# Altium schematic sheet DACard.SchDoc: 32-Channel 12-bit DA-Card (Range: 0-23V)
size A4; SheetNumber: 1; SheetTotal: 3
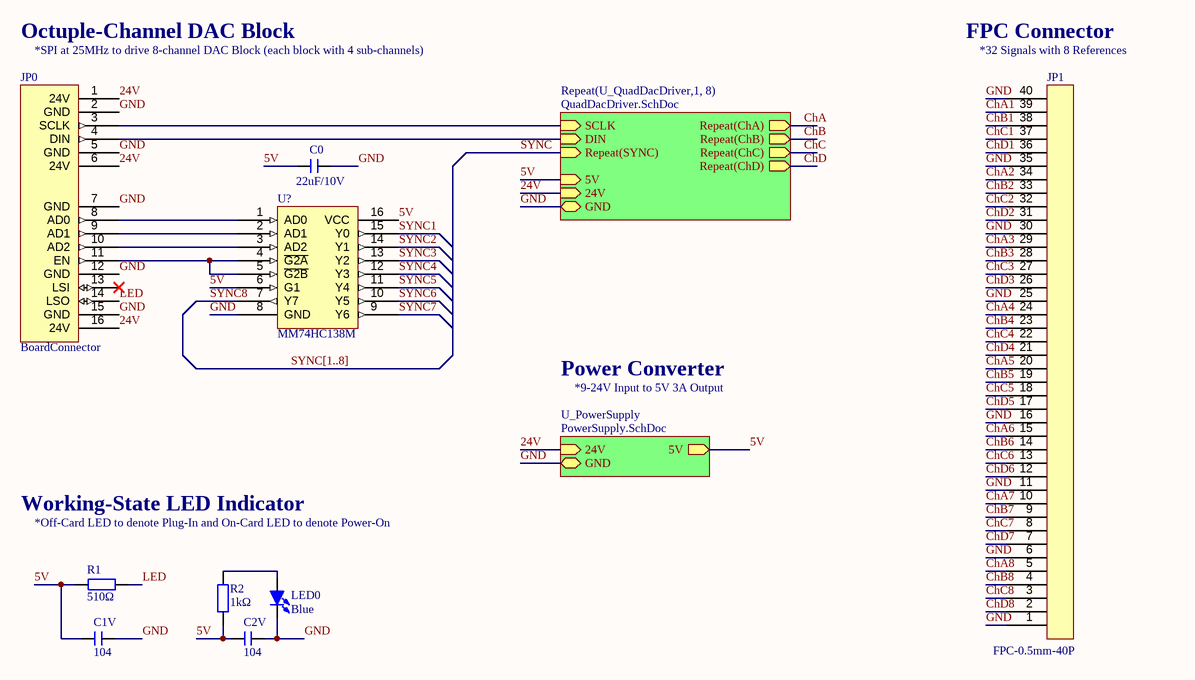
[diagram p0: DACard.SchDoc]

## Parts
C0  22uF/10V  [C 0603_L]
C1V  104  [C 0603_L]
C2V  104  [C 0603_L]
JP0  BoardConnector  [HDR2.54-DIY16-PW]
JP1  FPC-0.5mm-40P  [FPC0.5 2H-WS-40P]
LED0  Blue  [LED 0603B]
R1  510Ω  [R 0603_L]
R2  1kΩ  [R 0603_L]
U?  MM74HC138M  [SO16NB]

## Sub-sheets
Repeat(U_QuadDacDriver,1, 8) = QuadDacDriver.SchDoc: SCLK (in), Repeat(SYNC) (in), DIN (in), 5V (in), GND (bidir), 24V (in), Repeat(ChA) (out), Repeat(ChB) (out), Repeat(ChC) (out), Repeat(ChD) (out)
U_PowerSupply = PowerSupply.SchDoc: 24V (in), GND (bidir), 5V (out)

## Nets
5V: C0.1 C1V.1 C2V.1 R1.1 R2.1 U?.6(G1) U?.16(VCC) ; sheet U_PowerSupply/5V, sheet Repeat(U_QuadDacDriver,1, 8)/5V
24V: JP0.1(24V) JP0.6(24V) JP0.16(24V) ; sheet U_PowerSupply/24V, sheet Repeat(U_QuadDacDriver,1, 8)/24V
ChA: sheet Repeat(U_QuadDacDriver,1, 8)/Repeat(ChA)
ChA1: JP1.39
ChA2: JP1.34
ChA3: JP1.29
ChA4: JP1.24
ChA5: JP1.20
ChA6: JP1.15
ChA7: JP1.10
ChA8: JP1.5
ChB: sheet Repeat(U_QuadDacDriver,1, 8)/Repeat(ChB)
ChB1: JP1.38
ChB2: JP1.33
ChB3: JP1.28
ChB4: JP1.23
ChB5: JP1.19
ChB6: JP1.14
ChB7: JP1.9
ChB8: JP1.4
ChC: sheet Repeat(U_QuadDacDriver,1, 8)/Repeat(ChC)
ChC1: JP1.37
ChC2: JP1.32
ChC3: JP1.27
ChC4: JP1.22
ChC5: JP1.18
ChC6: JP1.13
ChC7: JP1.8
ChC8: JP1.3
ChD: sheet Repeat(U_QuadDacDriver,1, 8)/Repeat(ChD)
ChD1: JP1.36
ChD2: JP1.31
ChD3: JP1.26
ChD4: JP1.21
ChD5: JP1.17
ChD6: JP1.12
ChD7: JP1.7
ChD8: JP1.2
GND: C0.2 C1V.2 C2V.2 JP0.2(GND) JP0.5(GND) JP0.7(GND) JP0.12(GND) JP0.15(GND) JP1.1 JP1.6 JP1.11 JP1.16 JP1.25 JP1.30 JP1.35 JP1.40 LED0.2(K) U?.8(GND) ; sheet U_PowerSupply/GND, sheet Repeat(U_QuadDacDriver,1, 8)/GND
LED: JP0.14(LSO) R1.2
SYNC: sheet Repeat(U_QuadDacDriver,1, 8)/Repeat(SYNC)
SYNC1: U?.15(Y0)
SYNC2: U?.14(Y1)
SYNC3: U?.13(Y2)
SYNC4: U?.12(Y3)
SYNC5: U?.11(Y4)
SYNC6: U?.10(Y5)
SYNC7: U?.9(Y6)
SYNC8: U?.7(Y7)
NetJP0_3: JP0.3(SCLK) ; sheet Repeat(U_QuadDacDriver,1, 8)/SCLK
NetJP0_4: JP0.4(DIN) ; sheet Repeat(U_QuadDacDriver,1, 8)/DIN
NetJP0_8: JP0.8(AD0) U?.1(AD0)
NetJP0_9: JP0.9(AD1) U?.2(AD1)
NetJP0_10: JP0.10(AD2) U?.3(AD2)
NetJP0_11: JP0.11(EN) U?.4(~{G2A}) U?.5(~{G2B})
NetLED0_1: LED0.1(A) R2.2

Not connected (* = marked no-connect by the designer): JP0 13(LSI)*

## Buses and harness runs
bus SYNC[1..8]

## Notes on the sheet
- Octuple-Channel DAC Block
- (near JP0) *SPI at 25MHz to drive 8-channel DAC Block (each block with 4 sub-channels)
- FPC Connector
- (near JP1) *32 Signals with 8 References
- Power Converter
- *9-24V Input to 5V 3A Output
- Working-State LED Indicator
- *Off-Card LED to denote Plug-In and On-Card LED to denote Power-On
- Title
- FileName:
- Version:
- Date:
- Project
- Designed By:
- Descriptions:
- Sheet:
- of

## Library data of the parts
C0 = C: 贴片电容 C2992620; BOM名称: 无极性贴片电容; 淘宝ID: 封装库来自淘宝 ID：黄晶宝石; 联系售后，技术支持: https://shop463601444.taobao.com; 唯一出售店铺网址: https://shop463601444.taobao.com
C1V C2V = C: 贴片电容; BOM名称: 无极性贴片电容; 淘宝ID: 封装库来自淘宝 ID：黄晶宝石; 联系售后，技术支持: https://shop463601444.taobao.com; 唯一出售店铺网址: https://shop463601444.taobao.com
JP0 = BoardConnector: DIY Board Connector (P/N); System: Connector
JP1 = FPC-0.5mm-40P: FPC Connector 0.5mm 40PIN
LED0 = LED-SMD: 贴片LED C118339; 版权归属: 封装库来自淘宝 ID：黄晶宝石; BOM名称: 贴片LED; 学习资源: https://shop463601444.taobao.com
R1 = R: 贴片电阻 C3017743; 版权归属: 来自淘宝 ID：黄晶宝石; 封装库来自淘宝卖家 ID：黄晶宝石: 其他店铺购入均为盗版，不享受售后技术支持服务，请立即申请退款; BOM名称: 贴片电阻; 联系售后: https://shop463601444.taobao.com
R2 = R: 贴片电阻 C51218; 版权归属: 来自淘宝 ID：黄晶宝石; 封装库来自淘宝卖家 ID：黄晶宝石: 其他店铺购入均为盗版，不享受售后技术支持服务，请立即申请退款; BOM名称: 贴片电阻; 联系售后: https://shop463601444.taobao.com
U? = MM74HC138M: 3-to-8 Decoder